# Altium schematic sheet [07] - 5V VOLTAGE REGULATOR.SchDoc
size A2; DocumentNumber: 7; SheetNumber: 7; SheetTotal: 12; PageSetup: Record=PageOptions|CenterHorizontal=True|CenterVertical=True|PrintScale=0.73|XCorrection=1.00|YCorrection=1.00|PrintKind=0|BorderSize=5000000|LeftOffset=0|BottomOffset=0|Orientation=2|PaperLength=1000|PaperWidth=1000|Scale=100|PaperSource=7|PrintQuality=-3|MediaType=1|DitherType=10|PrintScaleMode=1|PaperKind=A3|PaperIndex=8
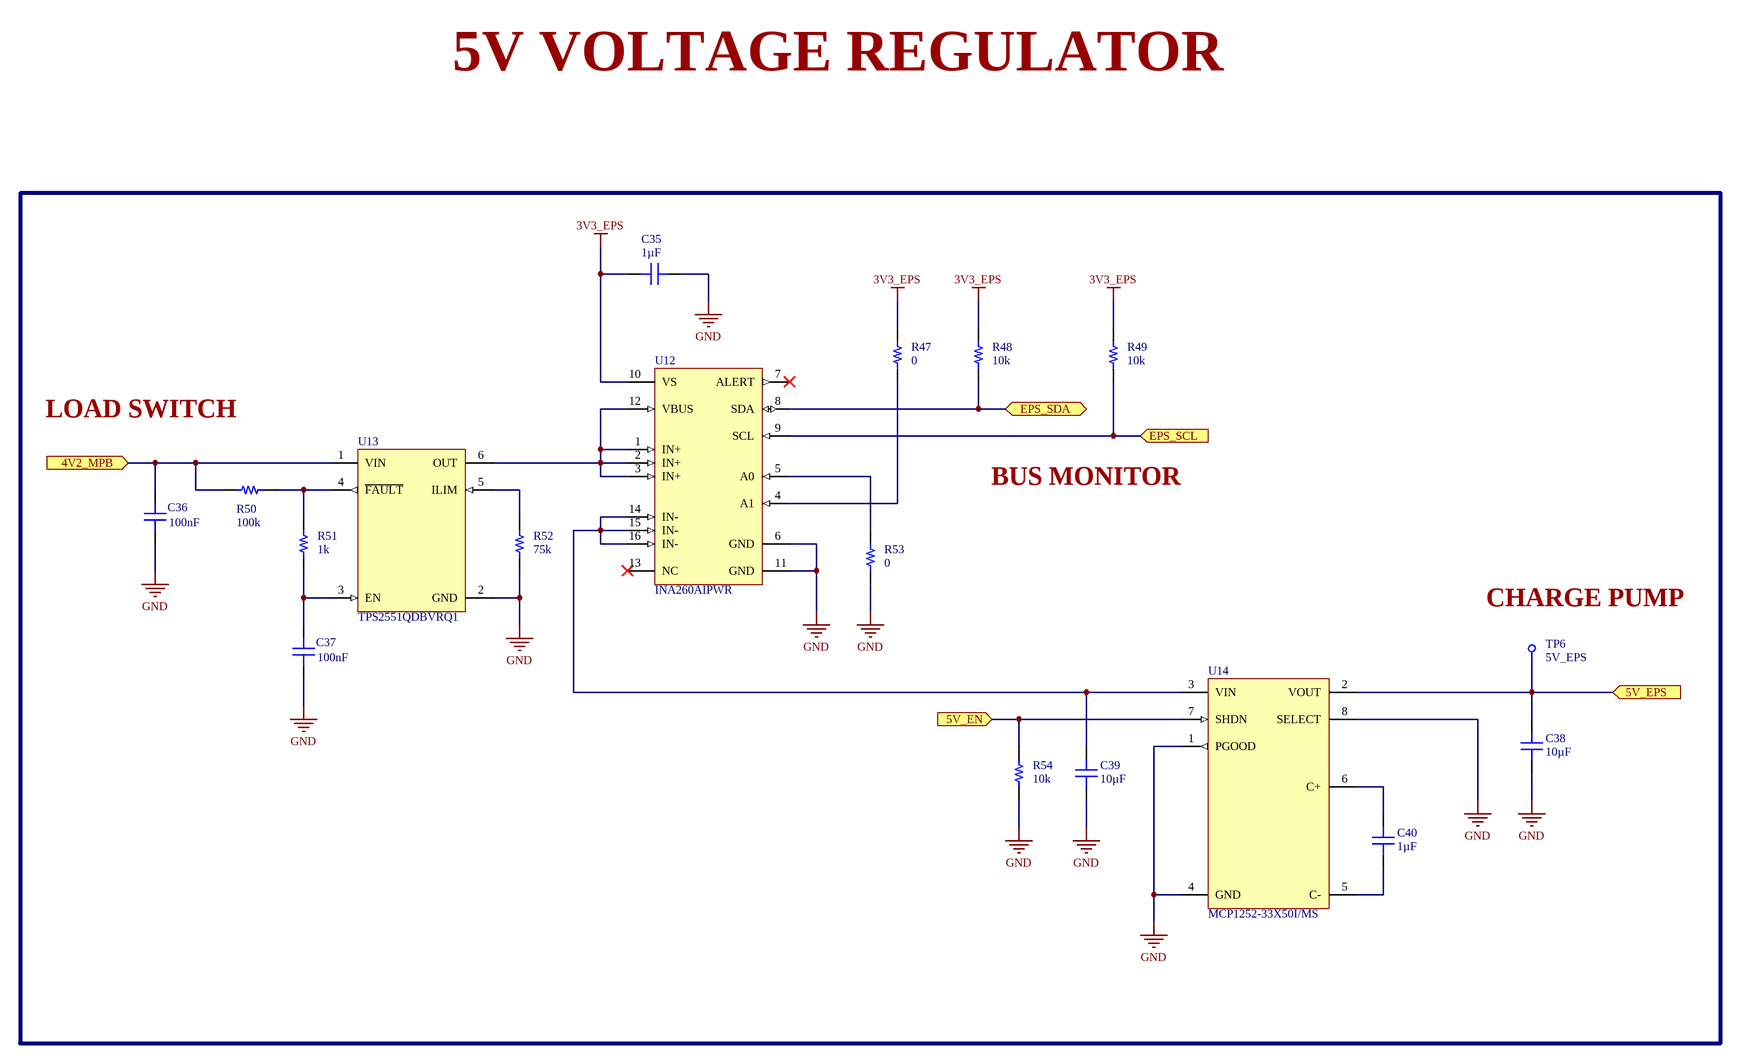
[diagram p0: [07] - 5V VOLTAGE REGULATOR.SchDoc]

## Parts
C35  Capacitance: 1µF  [CAP 0603/1608]  (hidden comment: CL10A105KP8NNNC)
C36  Capacitance: 100nF  [CAP 0603/1608]  (hidden comment: C0603C104K8RACTU)
C37  Capacitance: 100nF  [CAP 0603/1608]  (hidden comment: C0603C104K8RACTU)
C38  Capacitance: 10µF  [CAP 0603/1608]  (hidden comment: CL10A106MQ8NNNC)
C39  Capacitance: 10µF  [CAP 0603/1608]  (hidden comment: CL10A106MQ8NNNC)
C40  Capacitance: 1µF  [CAP 0603/1608]  (hidden comment: CL10A105KP8NNNC)
R47  Resistance: 0  [RES 0603/1608]  (hidden comment: RMCF0603ZT0R00)
R48  Resistance: 10k  [RES 0603/1608]  (hidden comment: RNCP0603FTD10K0)
R49  Resistance: 10k  [RES 0603/1608]  (hidden comment: RNCP0603FTD10K0)
R50  Resistance: 100k  [RES 0603/1608]  (hidden comment: CR0603-JW-104ELF)
R51  Resistance: 1k  [RES 0603/1608]  (hidden comment: ESR03EZPJ102)
R52  Resistance: 75k  [RES 0603/1608]  (hidden comment: ERJ3EKF7502V)
R53  Resistance: 0  [RES 0603/1608]  (hidden comment: RMCF0603ZT0R00)
R54  Resistance: 10k  [RES 0603/1608]  (hidden comment: RNCP0603FTD10K0)
TP6  5V_EPS  [Testpoint]
U12  INA260AIPWR  [TSOP65P640X120-16N]
U13  TPS2551QDBVRQ1  [SOT23-6]
U14  MCP1252-33X50I/MS  [8-MSOP]

## Ports
4V2_MPB (in), 5V_EN (in), 5V_EPS (in), EPS_SCL (in), EPS_SDA (bidir)

## Nets
3V3_EPS: C35.1 R47.2 R48.2 R49.2 U12.10(VS)
GND: C35.2 C36.1 C37.1 C38.1 C39.1 R52.1 R53.1 R54.1 U12.6(GND) U12.11(GND) U13.2(GND) U14.1(PGOOD) U14.4(GND) U14.8(SELECT)
4V2_MPB: C36.2 R50.1 U13.1(VIN) ; port 4V2_MPB
5V_EN: R54.2 U14.7(SHDN) ; port 5V_EN
5V_EPS: C38.2 TP6.1 U14.2(VOUT) ; port 5V_EPS
EPS_SCL: R49.1 U12.9(SCL) ; port EPS_SCL
EPS_SDA: R48.1 U12.8(SDA) ; port EPS_SDA
NetC37_2: C37.2 R51.1 U13.3(EN)
NetC39_2: C39.2 U12.14(IN-) U12.15(IN-) U12.16(IN-) U14.3(VIN)
NetC40_1: C40.1 U14.5(C-)
NetC40_2: C40.2 U14.6(C+)
NetR47_1: R47.1 U12.4(A1)
NetR50_2: R50.2 R51.2 U13.4(~{FAULT})
NetR52_2: R52.2 U13.5(ILIM)
NetR53_2: R53.2 U12.5(A0)
NetU12_1: U12.1(IN+) U12.2(IN+) U12.3(IN+) U12.12(VBUS) U13.6(OUT)

Not connected (* = marked no-connect by the designer): U12 7(ALERT)* 13(NC)*

## Notes on the sheet
- 5V VOLTAGE REGULATOR
- LOAD SWITCH
- BUS MONITOR
- (near TP6) CHARGE PUMP
- Project:
- Page Contents:
- Size:
- Revision:
- A2
- Document Number:
- Design:
- Date:
- Sheet
- of

## Library data of the parts
C35 C40 = CL10A105KP8NNNC: CAP CER 1UF 10V X5R 0603; Manufacturer: Samsung; Tolerance: 10%; Supplier 1: Digi-Key; Manufacturer Part Number: CL10A105KP8NNNC; Stock 1: 4411775; Pricing 1: 1 = 0.10000, 10 = 0.03800, 100 = 0.01680, 500 = 0.01200, 1000 = 0.00943 (USD); RoHS: Yes; Mount: Surface Mount; Case/Package: 0603; Case Code (Metric): 1608; Case Code (Imperial): 0603; Contact Plating: Tin; Min Operating Temperature: -55°C; Max Operating Temperature: 85°C; Packaging: Tape and Reel; Package Quantity: 1; Voltage Rating: 10V; Dielectric: X5R; Voltage: 10V; Length: 1.6mm; Height: 0.8mm; Width: 0.031inch; Thickness: 0.035inch; Depth: 0.8mm; Radiation Hardening: No; ComponentLink1URL: https://datasheet.ciiva.com/15195/getdatasheetpartid-358616-15195708.pdf?src-supplier=Verical; ComponentLink1Description: https://datasheet.ciiva.com/15195/getdatasheetpartid-358616-15195708.pdf?src-supplier=Verical; ComponentLink2URL: https://datasheet.ciiva.com/16358/cl05b104kq5nnnc-16358431.pdf?src-supplier=Future+Electronics; ComponentLink2Description: https://datasheet.ciiva.com/16358/cl05b104kq5nnnc-16358431.pdf?src-supplier=Future+Electronics; Supplier Part Number 1: 1276-1182-1-ND
C36 C37 = C0603C104K8RACTU: CAP CER 0.1UF 10V X7R 0603; Manufacturer: KEMET; Dielectric Material: Ceramic; Tolerance: 10%; Dissipation Factor: 5%; Supplier 1: Digi-Key; Manufacturer Part Number: C0603C104K8RACTU; Stock 1: 778651; Pricing 1: 1=0.15, 10=0.107, 100=0.0504, 500=0.03536, 1000=0.02927 (USD); Mount: Surface Mount,PCB; Case/Package: 0603; Number of Pins: 2; Case Code (Imperial): 0603; Case Code (Metric): 1608; Contact Plating: Tin,Matte; Min Operating Temperature: -55°C; Max Operating Temperature: 125°C; Voltage Rating: 10V; Packaging: Tape and Reel; Package Quantity: 1; Voltage Rating (DC): 10V; Dielectric: X7R; Termination: SMD/SMT; Voltage: 10V; Length: 1.6mm; Height: 0.8mm; Width: 0.8mm; Lead Pitch: 0.7mm; Thickness: 0.034inch; Depth: 0.8mm; Radiation Hardening: No; REACH SVHC: No SVHC; ComponentLink1URL: http://www.farnell.com/datasheets/2315110.pdf?src-supplier=Farnell; ComponentLink1Description: http://www.farnell.com/datasheets/2315110.pdf?src-supplier=Farnell; ComponentLink2URL: http://www.kemet.com/kemet/web/homepage/kechome.nsf/vapubfiles/KEM_C1002_X7R_SMD.pdf/$file/KEM_C1002_X7R_SMD.pdf?src-supplier=Element14; ComponentLink2Description: http://www.kemet.com/kemet/web/homepage/kechome.nsf/vapubfiles/KEM_C1002_X7R_SMD.pdf/$file/KEM_C1002_X7R_SMD.pdf?src-supplier=Element14; ComponentLink3URL: https://www.verical.com/server-webapp/html/getDatasheet?partID=91529&src-supplier=Verical; ComponentLink3Description: https://www.verical.com/server-webapp/html/getDatasheet?partID=91529&src-supplier=Verical; ComponentLink4URL: http://www.mouser.com/ds/2/212/KEM_C1002_X7R_SMD-1102033.pdf?src-supplier=Mouser; ComponentLink4Description: http://www.mouser.com/ds/2/212/KEM_C1002_X7R_SMD-1102033.pdf?src-supplier=Mouser; ComponentLink5URL: http://www.alliedelec.com/m/d/9bfe7773041ffe9d406e68bc7b377fdd.pdf?src-supplier=Allied+Electronics; ComponentLink5Description: http://www.alliedelec.com/m/d/9bfe7773041ffe9d406e68bc7b377fdd.pdf?src-supplier=Allied+Electronics; ComponentLink6URL: http://www.farnell.com/datasheets/1851736.pdf?src-supplier=Element14; ComponentLink6Description: http://www.farnell.com/datasheets/1851736.pdf?src-supplier=Element14; Supplier Part Number 1: 399-1095-1-ND
C38 C39 = CL10A106MQ8NNNC: CAP CER 10UF 6.3V X5R 0603; Manufacturer: Samsung; Tolerance: 20%; Supplier 1: Digi-Key; Manufacturer Part Number: CL10A106MQ8NNNC; Stock 1: 3866590; Pricing 1: 1 = 0.15000, 10 = 0.11000, 100 = 0.05150, 500 = 0.03614, 1000 = 0.02992 (USD); RoHS: Yes; Mount: Surface Mount; Case/Package: 0603; Case Code (Metric): 1608; Case Code (Imperial): 0603; Contact Plating: Tin; Min Operating Temperature: -55°C; Max Operating Temperature: 85°C; Package Quantity: 1; Packaging: Tape and Reel; Voltage Rating: 6.3V; Dielectric: X5R; Voltage: 6.3V; Length: 1.6mm; Height: 0.8mm; Width: 0.031inch; Thickness: 0.035inch; Depth: 0.8mm; Radiation Hardening: No; ComponentLink1URL: https://datasheet.ciiva.com/25798/cl10a106mq8nnnc-25798320.pdf?src-supplier=Digi-Key; ComponentLink1Description: https://datasheet.ciiva.com/25798/cl10a106mq8nnnc-25798320.pdf?src-supplier=Digi-Key; ComponentLink2URL: https://datasheet.ciiva.com/26838/getdatasheetpartid-357557-26838347.pdf?src-supplier=Verical; ComponentLink2Description: https://datasheet.ciiva.com/26838/getdatasheetpartid-357557-26838347.pdf?src-supplier=Verical; ComponentLink3URL: https://datasheet.ciiva.com/16437/cl05b104kq5nnnc-16437327.pdf?src-supplier=Future+Electronics; ComponentLink3Description: https://datasheet.ciiva.com/16437/cl05b104kq5nnnc-16437327.pdf?src-supplier=Future+Electronics; Supplier Part Number 1: 1276-1119-1-ND
R47 R53 = RMCF0603ZT0R00: RES SMD 0 OHM JUMPER 1/10W 0603; Manufacturer: Stackpole Electronics; Power Rating: 100mW; Current Rating: 1A; Working Voltage: 75V; Supplier 1: Digi-Key; Manufacturer Part Number: RMCF0603ZT0R00; Stock 1: 3031399; Pricing 1: 1 = 0.10000, 10 = 0.01600, 25 = 0.01160, 50 = 0.00880, 100 = 0.00640, 250 = 0.00492, 500 = 0.00392, 1000 = 0.00289 (USD); RoHS: Yes; Mount: Surface Mount; Case/Package: 0603; Case Code (Metric): 1608; Case Code (Imperial): 0603; Contact Plating: Tin; Min Operating Temperature: -55°C; Max Operating Temperature: 155°C; Packaging: Tape and Reel; Composition: Thick Film; Number of Terminations: 2; Military Standard: Not; Max Power Dissipation: 100mW; Features: Automotive AEC-Q200; Length: 1.55mm; Height: 0.022inch; Width: 0.031inch; Depth: 0.8mm; Radiation Hardening: No; Lead Free: Lead Free; ComponentLink1URL: https://www.seielect.com/catalog/SEI-Packaging.pdf?src-supplier=Avnet; ComponentLink1Description: https://www.seielect.com/catalog/SEI-Packaging.pdf?src-supplier=Avnet; ComponentLink2URL: https://www.seielect.com/catalog/SEI-Packaging.pdf?src-supplier=Verical; ComponentLink2Description: https://www.seielect.com/catalog/SEI-Packaging.pdf?src-supplier=Verical; ComponentLink3URL: https://www.seielect.com/catalog/SEI-Packaging.pdf?src-supplier=Arrow; ComponentLink3Description: https://www.seielect.com/catalog/SEI-Packaging.pdf?src-supplier=Arrow; ComponentLink4URL: https://www.seielect.com/catalog/SEI-Packaging.pdf?src-supplier=Digi-Key; ComponentLink4Description: https://www.seielect.com/catalog/SEI-Packaging.pdf?src-supplier=Digi-Key; ComponentLink5URL: https://www.seielect.com/Catalog/SEI-RMCF_RMCP.pdf?src-supplier=Digi-Key; ComponentLink5Description: https://www.seielect.com/Catalog/SEI-RMCF_RMCP.pdf?src-supplier=Digi-Key; ComponentLink6URL: https://www.seielect.com/catalog/SEI-Packaging.pdf?src-supplier=Future+Electronics; ComponentLink6Description: https://www.seielect.com/catalog/SEI-Packaging.pdf?src-supplier=Future+Electronics; Supplier Part Number 1: RMCF0603ZT0R00CT-ND
R48 R49 R54 = RNCP0603FTD10K0: RES SMD 10K OHM 1% 1/8W 0603; Manufacturer: Stackpole Electronics; Max Power Dissipation: 125mW; Temperature Coefficient: 100ppm/°C; Supplier 1: Digi-Key; Manufacturer Part Number: RNCP0603FTD10K0; Stock 1: 579582; Pricing 1: 1 = 0.10000, 10 = 0.06700, 100 = 0.02730, 1000 = 0.01224, 2500 = 0.01063 (USD); RoHS: Yes; Mount: Surface Mount; Case/Package: 0603; Case Code (Metric): 1608; Case Code (Imperial): 0603; Contact Plating: Tin; Min Operating Temperature: -55°C; Max Operating Temperature: 155°C; Packaging: Tape and Reel; Tolerance: 1%; Composition: Thin Film; Number of Terminations: 2; Features: Moisture Resistant; Length: 0.059inch; Height: 0.02inch; Width: 0.031inch; Radiation Hardening: No; Lead Free: Lead Free; ComponentLink1URL: https://www.seielect.com/Catalog/SEI-rncp.pdf?src-supplier=Avnet; ComponentLink1Description: https://www.seielect.com/Catalog/SEI-rncp.pdf?src-supplier=Avnet; ComponentLink2URL: https://www.seielect.com/catalog/SEI-Packaging.pdf?src-supplier=Digi-Key; ComponentLink2Description: https://www.seielect.com/catalog/SEI-Packaging.pdf?src-supplier=Digi-Key; ComponentLink3URL: https://www.seielect.com/Catalog/SEI-rncp.pdf?src-supplier=Digi-Key; ComponentLink3Description: https://www.seielect.com/Catalog/SEI-rncp.pdf?src-supplier=Digi-Key; Supplier Part Number 1: RNCP0603FTD10K0CT-ND
R50 = CR0603-JW-104ELF: RES SMD 100K OHM 5% 1/10W 0603; Manufacturer: Bourns; Power Rating: 100mW; Voltage Rating: 50V; Temperature Coefficient: 200ppm/°C; Supplier 1: Digi-Key; Manufacturer Part Number: CR0603-JW-104ELF; Stock 1: 138181; Pricing 1: 1 = 0.10000, 10 = 0.01500, 25 = 0.01080, 50 = 0.00840, 100 = 0.00610, 250 = 0.00468, 500 = 0.00374, 1000 = 0.00275 (USD); RoHS: Yes; Mount: Surface Mount; Case/Package: 0603; Number of Pins: 2; Case Code (Imperial): 0603; Case Code (Metric): 1608; Contact Plating: Tin; Min Operating Temperature: -55°C; Max Operating Temperature: 155°C; Packaging: Tape and Reel; Tolerance: 5%; Package Quantity: 5000; Composition: Thick Film; Termination: SMD/SMT; Working Voltage: 50V; Military Standard: Not; Voltage Rating (DC): 50V; Length: 1.6mm; Height: 0.45mm; Width: 0.8mm; Depth: 0.8mm; Thickness: 457um; Radiation Hardening: No; REACH SVHC: No SVHC; ComponentLink1URL: https://datasheet.ciiva.com/22713/691949-22713239.pdf?src-supplier=Element14; ComponentLink1Description: https://datasheet.ciiva.com/22713/691949-22713239.pdf?src-supplier=Element14; ComponentLink2URL: https://datasheet.ciiva.com/23776/1902866-23776391.pdf?src-supplier=Newark; ComponentLink2Description: https://datasheet.ciiva.com/23776/1902866-23776391.pdf?src-supplier=Newark; ComponentLink3URL: https://datasheet.ciiva.com/16766/70154685-16766760.pdf?src-supplier=Allied+Electronics; ComponentLink3Description: https://datasheet.ciiva.com/16766/70154685-16766760.pdf?src-supplier=Allied+Electronics; ComponentLink4URL: https://datasheet.ciiva.com/30229/159chpreztr-30229129.pdf?src-supplier=Onlinecomponents.com; ComponentLink4Description: https://datasheet.ciiva.com/30229/159chpreztr-30229129.pdf?src-supplier=Onlinecomponents.com; ComponentLink5URL: https://datasheet.ciiva.com/16935/chpreztr-16935963.pdf?src-supplier=Avnet+Europe; ComponentLink5Description: https://datasheet.ciiva.com/16935/chpreztr-16935963.pdf?src-supplier=Avnet+Europe; ComponentLink6URL: https://datasheet.ciiva.com/5543/chpreztr-5543676.pdf?src-supplier=Mouser; ComponentLink6Description: https://datasheet.ciiva.com/5543/chpreztr-5543676.pdf?src-supplier=Mouser; ComponentLink7URL: https://datasheet.ciiva.com/9120/chpreztr-9120764.pdf?src-supplier=Avnet; ComponentLink7Description: https://datasheet.ciiva.com/9120/chpreztr-9120764.pdf?src-supplier=Avnet; ComponentLink8URL: https://datasheet.ciiva.com/46383/1791942-46383790.pdf?src-supplier=Element14; ComponentLink8Description: https://datasheet.ciiva.com/46383/1791942-46383790.pdf?src-supplier=Element14; ComponentLink9URL: https://datasheet.ciiva.com/48692/001055501-da-01-en-smd-wid-cr0603-jw-104elf-100k-ohm-1-10w-48692133.pdf?src-supplier=Conrad; ComponentLink9Description: https://datasheet.ciiva.com/48692/001055501-da-01-en-smd-wid-cr0603-jw-104elf-100k-ohm-1-10w-48692133.pdf?src-supplier=Conrad; Supplier Part Number 1: CR0603-JW-104ELFCT-ND
R51 = ESR03EZPJ102: RES SMD 1K OHM 5% 1/4W 0603; Manufacturer: Rohm; Temperature Coefficient: 200ppm/°C; Max Power Dissipation: 250mW; Supplier 1: Digi-Key; Manufacturer Part Number: ESR03EZPJ102; Stock 1: 187581; Pricing 1: 1 = 0.10000, 10 = 0.08300, 100 = 0.03180, 1000 = 0.01398, 2500 = 0.01207 (USD); RoHS: Yes; Case/Package: 0603; Case Code (Metric): 1608; Case Code (Imperial): 0603; Min Operating Temperature: -55°C; Max Operating Temperature: 155°C; Tolerance: 5%; Package Quantity: 1; Packaging: Tape and Reel; Composition: Thick Film; Number of Terminations: 2; Features: Automotive AEC-Q200; Length: 0.063inch; Height: 0.022inch; Width: 0.031inch; Lead Free: Lead Free; ComponentLink1URL: https://datasheet.ciiva.com/2469/esr-2469603.pdf?src-supplier=Digi-Key; ComponentLink1Description: https://datasheet.ciiva.com/2469/esr-2469603.pdf?src-supplier=Digi-Key; ComponentLink2URL: https://datasheet.ciiva.com/2469/esr-2469604.pdf?src-supplier=Digi-Key; ComponentLink2Description: https://datasheet.ciiva.com/2469/esr-2469604.pdf?src-supplier=Digi-Key; ComponentLink3URL: https://datasheet.ciiva.com/2469/esr-2469605.pdf?src-supplier=Digi-Key; ComponentLink3Description: https://datasheet.ciiva.com/2469/esr-2469605.pdf?src-supplier=Digi-Key; Supplier Part Number 1: RHM1.0KDCT-ND
R52 = ERJ3EKF7502V: RES SMD 75K OHM 1% 1/10W 0603; Manufacturer: Panasonic; Power Rating: 100mW; Voltage Rating: 75V; Temperature Coefficient: 100ppm/°C; Voltage Rating (DC): 50V; Supplier 1: Digi-Key; Manufacturer Part Number: ERJ3EKF7502V; Stock 1: 1035475; Pricing 1: 1 = 0.10000, 10 = 0.06500, 100 = 0.02640, 1000 = 0.01186, 2500 = 0.01029 (USD); RoHS: Yes; Mount: Surface Mount; Case/Package: 0603; Case Code (Metric): 1608; Case Code (Imperial): 0603; Contact Plating: Tin; Min Operating Temperature: -55°C; Max Operating Temperature: 155°C; Tolerance: 1%; Packaging: Tape and Reel; Package Quantity: 1; Composition: Thick Film; Number of Terminations: 2; Termination: SMD/SMT; Military Standard: Not; Max Power Dissipation: 100mW; Features: Automotive AEC-Q200; Length: 1.6mm; Height: 0.45mm; Width: 0.031inch; Depth: 0.8mm; Radiation Hardening: No; REACH SVHC: No SVHC; Lead Free: Lead Free; ComponentLink1URL: https://datasheet.ciiva.com/34303/1988401-34303605.pdf?src-supplier=Jameco; ComponentLink1Description: https://datasheet.ciiva.com/34303/1988401-34303605.pdf?src-supplier=Jameco; ComponentLink2URL: https://datasheet.ciiva.com/24069/aoa0000ce2-24069064.pdf?src-supplier=Mouser; ComponentLink2Description: https://datasheet.ciiva.com/24069/aoa0000ce2-24069064.pdf?src-supplier=Mouser; ComponentLink3URL: https://datasheet.ciiva.com/28596/1678782-28596232.pdf?src-supplier=Element14; ComponentLink3Description: https://datasheet.ciiva.com/28596/1678782-28596232.pdf?src-supplier=Element14; ComponentLink4URL: https://datasheet.ciiva.com/15159/getdatasheetpartid-28812-15159210.pdf?src-supplier=Verical; ComponentLink4Description: https://datasheet.ciiva.com/15159/getdatasheetpartid-28812-15159210.pdf?src-supplier=Verical; ComponentLink5URL: https://datasheet.ciiva.com/31835/aoa0000ce2-31835674.pdf?src-supplier=Onlinecomponents.com; ComponentLink5Description: https://datasheet.ciiva.com/31835/aoa0000ce2-31835674.pdf?src-supplier=Onlinecomponents.com; ComponentLink6URL: https://datasheet.ciiva.com/28676/1678782-28676971.pdf?src-supplier=Element14; ComponentLink6Description: https://datasheet.ciiva.com/28676/1678782-28676971.pdf?src-supplier=Element14; ComponentLink7URL: https://datasheet.ciiva.com/46374/426256-46374235.pdf?src-supplier=Element14; ComponentLink7Description: https://datasheet.ciiva.com/46374/426256-46374235.pdf?src-supplier=Element14; ComponentLink8URL: https://datasheet.ciiva.com/48531/aoa0000ce2-48531550.pdf?src-supplier=Avnet; ComponentLink8Description: https://datasheet.ciiva.com/48531/aoa0000ce2-48531550.pdf?src-supplier=Avnet; ComponentLink9URL: https://datasheet.ciiva.com/9187/aoa0000ce2-9187719.pdf?src-supplier=Avnet; ComponentLink9Description: https://datasheet.ciiva.com/9187/aoa0000ce2-9187719.pdf?src-supplier=Avnet; Supplier Part Number 1: P75.0KHCT-ND
TP6 = Testpoint: GENERIC TESTPOINT
U12 = INA260AIPWR: IC MONITOR PWR/CURR 16TSSOP; Manufacturer: Texas Instruments; Accuracy: 0.02%; Output Current: 10mA; Supplier 1: Digi-Key; Manufacturer Part Number: INA260AIPWR; Stock 1: 4446; Pricing 1: 1=4.54, 10=4.077, 100=3.3401, 500=2.8434, 1000=2.39805 (USD); Mount: Surface Mount; Case/Package: TSSOP; Number of Pins: 16; Min Operating Temperature: -40°C; Max Operating Temperature: 125°C; Packaging: Tape and Reel; Supplier Part Number 1: 296-47777-1-ND
U13 = TPS2551QDBVRQ1: IC POWER-DIST SWITCH ADJ SOT23-6; Manufacturer: Texas Instruments; Min Supply Voltage: 2.5V; Max Supply Voltage: 6.5V; Max Power Dissipation: 625mW; Number of Outputs: 1; Output Current: 0pA; Interface: Serial; Max Input Voltage: 5.5V; Min Input Voltage: 4.5V; On-State Resistance: 85mR; Supplier 1: Digi-Key; Manufacturer Part Number: TPS2551QDBVRQ1; Stock 1: 5882; Pricing 1: 1 = 2.69000, 10 = 2.41700, 100 = 1.98040, 500 = 1.68586, 1000 = 1.42181 (USD); RoHS: Yes; Case/Package: SOT-23-6; Number of Pins: 6; Min Operating Temperature: -40°C; Max Operating Temperature: 125°C; Package Quantity: 3000; Packaging: Tape and Reel; Power Dissipation: 625mW; Radiation Hardening: No; REACH SVHC: No SVHC; Lead Free: Lead Free; ComponentLink1URL: https://datasheet.ciiva.com/1962/tps2551-q1-1962640.pdf?src-supplier=Digi-Key; ComponentLink1Description: https://datasheet.ciiva.com/1962/tps2551-q1-1962640.pdf?src-supplier=Digi-Key; ComponentLink2URL: https://datasheet.ciiva.com/4924/slvs850-120518-4924547.pdf?src-supplier=Mouser; ComponentLink2Description: https://datasheet.ciiva.com/4924/slvs850-120518-4924547.pdf?src-supplier=Mouser; ComponentLink3URL: https://datasheet.ciiva.com/3233/tps2551-q1-3233588.pdf?src-supplier=Avnet; ComponentLink3Description: https://datasheet.ciiva.com/3233/tps2551-q1-3233588.pdf?src-supplier=Avnet; ComponentLink4URL: https://datasheet.ciiva.com/15109/getdatasheetpartid-329852-15109046.pdf?src-supplier=Verical; ComponentLink4Description: https://datasheet.ciiva.com/15109/getdatasheetpartid-329852-15109046.pdf?src-supplier=Verical; ComponentLink5URL: https://datasheet.ciiva.com/15258/slvs850-15258699.pdf?src-supplier=Arrow+Europe; ComponentLink5Description: https://datasheet.ciiva.com/15258/slvs850-15258699.pdf?src-supplier=Arrow+Europe; ComponentLink6URL: https://datasheet.ciiva.com/1962/tps2551-q1-1962641.pdf?src-supplier=Digi-Key; ComponentLink6Description: https://datasheet.ciiva.com/1962/tps2551-q1-1962641.pdf?src-supplier=Digi-Key; ComponentLink7URL: https://datasheet.ciiva.com/1962/tps2551-q1-1962642.pdf?src-supplier=Digi-Key; ComponentLink7Description: https://datasheet.ciiva.com/1962/tps2551-q1-1962642.pdf?src-supplier=Digi-Key; Supplier Part Number 1: 296-23692-1-ND
U14 = MCP1252-33X50I/MS: IC REG SWITCHD CAP PROG 8MSOP; Manufacturer: Microchip; Max Output Current: 120mA; Max Supply Voltage: 5.5V; Min Supply Voltage: 2.1V; Output Current: 150mA; Number of Outputs: 1; Output Voltage: 5V; Current Rating: 80A; Min Input Voltage: 2V; Nominal Output Voltage: 3.3V; Switching Frequency: 10kHz; Topology: Charge Pump; Output Type: Fixed; Supplier 1: Digi-Key; Manufacturer Part Number: MCP1252-33X50I/MS; Stock 1: 4906; Pricing 1: 1 = 1.41000, 25 = 1.17440, 100 = 1.07120 (USD); RoHS: Yes; Mount: Surface Mount; Case/Package: MSOP; Number of Pins: 8; Weight: 0.004938oz; Min Operating Temperature: -40°C; Max Operating Temperature: 85°C; Packaging: Rail/Tube; Max Input Voltage: 5.5V; Length: 3mm; Height: 0.85mm; Width: 3mm; Radiation Hardening: No; REACH SVHC: No SVHC; Lead Free: Lead Free; ComponentLink1URL: https://datasheet.ciiva.com/14666/0900766b80cb4e26-14666598.pdf?src-supplier=RSComponents; ComponentLink1Description: https://datasheet.ciiva.com/14666/0900766b80cb4e26-14666598.pdf?src-supplier=RSComponents; ComponentLink2URL: https://datasheet.ciiva.com/15114/getdatasheetpartid-786042-15114189.pdf?src-supplier=Verical; ComponentLink2Description: https://datasheet.ciiva.com/15114/getdatasheetpartid-786042-15114189.pdf?src-supplier=Verical; ComponentLink3URL: https://datasheet.ciiva.com/41463/001085779-da-01-en-ic-reg-mult-mcp1252-33x50i-ms-msop-8-mcp-41463457.pdf?src-supplier=Conrad; ComponentLink3Description: https://datasheet.ciiva.com/41463/001085779-da-01-en-ic-reg-mult-mcp1252-33x50i-ms-msop-8-mcp-41463457.pdf?src-supplier=Conrad; ComponentLink4URL: https://datasheet.ciiva.com/2024/21752a-2024332.pdf?src-supplier=Digi-Key; ComponentLink4Description: https://datasheet.ciiva.com/2024/21752a-2024332.pdf?src-supplier=Digi-Key; ComponentLink5URL: https://datasheet.ciiva.com/14621/70046078-14621804.pdf?src-supplier=Allied+Electronics; ComponentLink5Description: https://datasheet.ciiva.com/14621/70046078-14621804.pdf?src-supplier=Allied+Electronics; ComponentLink6URL: https://datasheet.ciiva.com/4874/21752a-4874975.pdf?src-supplier=Mouser; ComponentLink6Description: https://datasheet.ciiva.com/4874/21752a-4874975.pdf?src-supplier=Mouser; ComponentLink7URL: https://datasheet.ciiva.com/16352/filehandler-aspxddocname-en011637-16352991.pdf?src-supplier=Future+Electronics; ComponentLink7Description: https://datasheet.ciiva.com/16352/filehandler-aspxddocname-en011637-16352991.pdf?src-supplier=Future+Electronics; ComponentLink8URL: https://datasheet.ciiva.com/17297/21752a-17297471.pdf?src-supplier=Avnet+Europe; ComponentLink8Description: https://datasheet.ciiva.com/17297/21752a-17297471.pdf?src-supplier=Avnet+Europe; Supplier Part Number 1: MCP1252-33X50I/MS-ND